# Altium schematic sheet Thermal_Sensor_1.SchDoc
size A
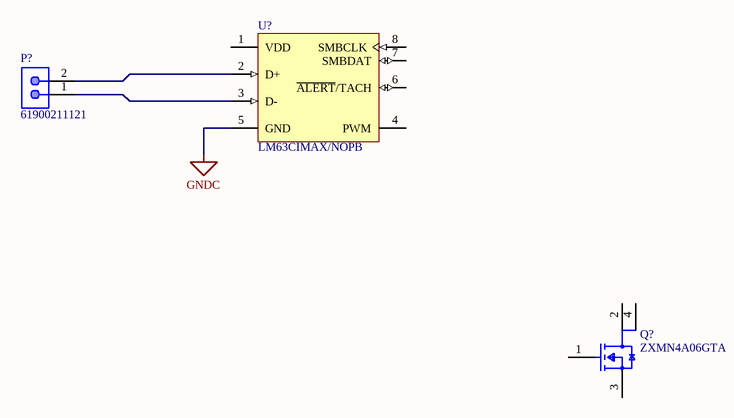
[diagram p0: Thermal_Sensor_1.SchDoc]

## Parts
P?  61900211121  [61900211121]
Q?  ZXMN4A06GTA  [FP-SOT223-MFG]
U?  LM63CIMAX/NOPB  [D0008A_M]

## Nets
GNDC: U?.5(GND)
NetP?_1: P?.1 U?.3(D-)
NetP?_2: P?.2 U?.2(D+)

Not connected (* = marked no-connect by the designer): Q? 1(G) 2(D) 3(S) 4(D); U? 1(VDD) 4(PWM) 6(~{ALERT}/TACH) 7(SMBDAT) 8(SMBCLK)

## Library data of the parts
P? = 61900211121: WR-WTB THT Male Vertical Locking Header, pitch 2.54mm, 2p; Pin Number: 2; Contact Resistance: 20mOhm; Rated Current: 3A; Withstanding Voltage: 1000VAC; Working Voltage: 250VAC; ComponentLink1Description: Manufacturer; ComponentLink1URL: http://www.we-online.de; ComponentLink2Description: Datasheet; ComponentLink2URL: https://www.we-online.com/catalog/datasheet/61900211121.pdf; Pitch: 2.54mm; Published Date: January 2020; Publisher: Wurth Elektronik; Mounting Technology: THT; Packaging: Bag; Operating Temperature: -40 to +105degC; Part Number: 61900211121; Gender: Male; Type: Vertical
Q? = CMP-12801-000020-1: MOSFET N-CH 40V 5A SOT223; Manufacturer: Diodes Inc.; Rthja Max: 62.5°C/W; Gate To Source Voltage: 20V; Number Of Channels: 1; Standoff Height: 0.01mm; Automotive Grade: Grade 0; Threshold Vgs Max: 2V; Drain To Source Resistance: 0.05Ω; Reverse Recovery Charge: 16.36nC; Reverse Recovery Time: 19.86ns; Input Capacitace At Vds: 770pF @ 40V; Max Forward Diode Voltage: 0.95V; Depletion Mode: False; Power Dissipation: 2W; Turn Off Delay Time: 28.61ns; Typ Forward Diode Voltage: 0.8V; Threshold Vgs Min: 1V; Pulse Drain Current: 22A; Gate Charge At Vgs: 18.2nC @ 10V; Transconductance: 8.7S; Description: Trans MOSFET N-CH 40V 7A 4-Pin(3+Tab) SOT-223 T/R; Max Junction Temp: +150°C; Turn On Delay Time: 2.55ns; Device Class L2: Transistors; Digikey Description: MOSFET N-CH 40V 5A SOT223; Ipc Land Pattern Name: SOT230P700X180-4; ComponentLink2Description: Datasheet; Manufacturer Part Number: ZXMN4A06GTA; Automotive: Yes; ComponentLink2URL: https://www.diodes.com/assets/Datasheets/ZXMN4A06G.pdf; Drain To Source Breakdown Voltage: 40V; Package: SOT223; Temperature Range High: +150°C; Height: 1.8mm; Octopart: https://octopart.com/zxmn4a06gta-diodes+inc.-660114; Mouser Description: MOSFET 40V N-Chnl UMOS; Lead Free: Yes; Number Of N Channels: 1; Device Class L1: Discrete Semiconductors; Drain To Source Voltage: 40V; RoHS: TRUE; Category: Trans; Temperature: -55°C to +150°C; Device Class L3: MOSFETs; Continuous Drain Current: 5A; Temperature Range Low: -55°C; Footprint Url: https://www.diodes.com/assets/Package-Files/SOT223.pdf
U? = CMP-0066-00098-3: ±1ºC/±3ºC Accurate Remote Diode Digital Temperature Sensor with Integrated Fan Control, 8-pin Narrow SOIC, Pb-Free; Manufacturer: Texas Instruments; CompType: Temp Sensor IC; PowerWise: Y; PackageTopMarking: NSZXTT*LM63*CIMA; PackageDescription: SOIC Narrow, 4.9 x 3.9 x 1.45mm, 8 Lead, 1.27mm Pitch; ComponentLink1Description: Datasheet URL; PinCount: 8; PackageReference: D0008A; Code_JEDEC: MS-012-AA; RoHS: Y; Code_IPC: SOIC127P600-8; ComponentLink1URL: http://www.ti.com/general/docs/lit/getliterature.tsp?genericPartNumber=LM63&fileType=pdf